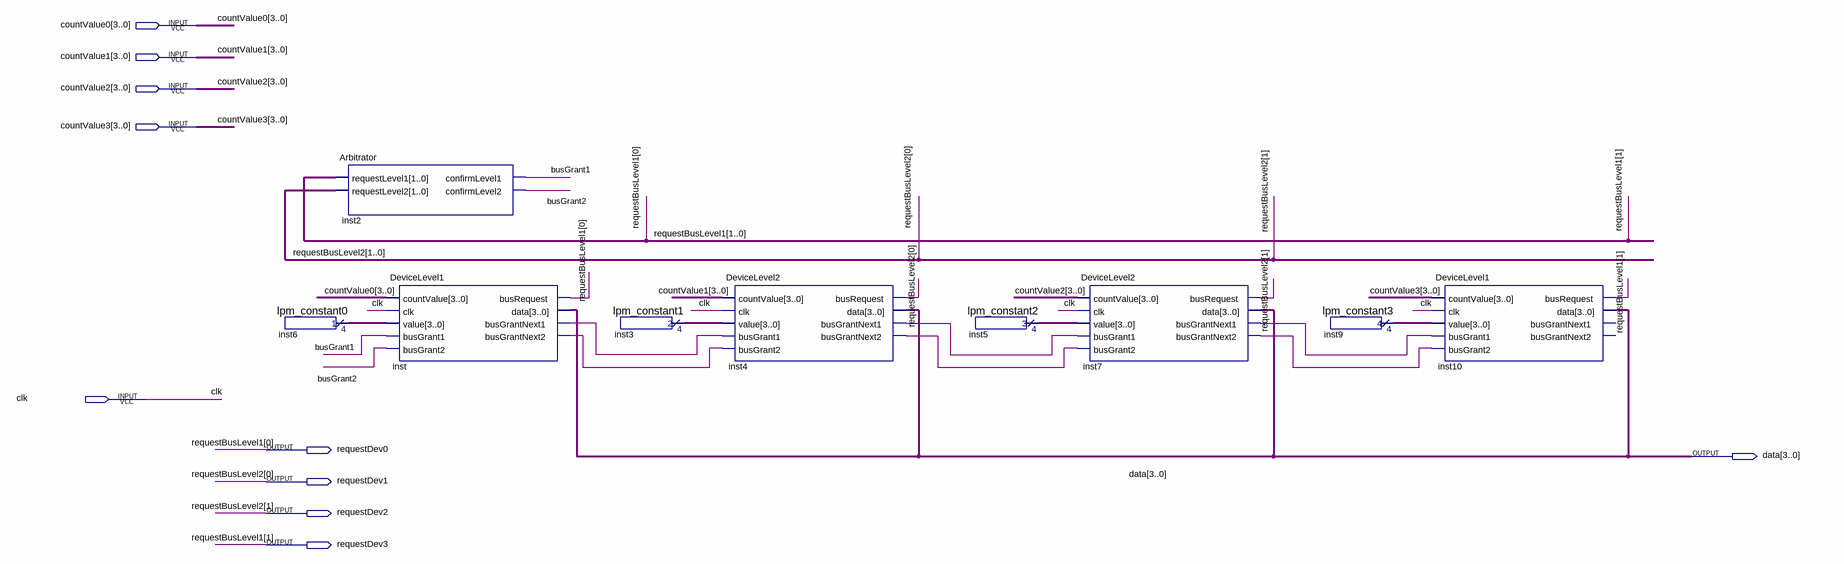
[diagram p0: schematic sheet]
// Quartus schematic Main.bdf as structural Verilog: 9 symbols, 10 pins
module Main (
  input  [3:0] countValue0,
  input  [3:0] countValue1,
  input  [3:0] countValue2,
  input  [3:0] countValue3,
  input  clk,
  output requestDev0,
  output [3:0] data,
  output requestDev1,
  output requestDev2,
  output requestDev3
);

  wire busGrant1, busGrant2, inst4_busgrantnext1, inst4_busgrantnext2, inst7_busgrantnext1,
       inst7_busgrantnext2, inst_busgrantnext1, inst_busgrantnext2;
  wire [3:0] inst3_result, inst5_result, inst6_result, inst9_result;

  lpm_constant0 inst6 (.result(inst6_result));
  Arbitrator inst2 (
    .requestLevel1({requestDev3, requestDev0}), .requestLevel2({requestDev2, requestDev1}),
    .confirmLevel1(busGrant1), .confirmLevel2(busGrant2));
  DeviceLevel1 inst (
    .countValue(countValue0), .clk(clk), .value(inst6_result), .busGrant1(busGrant1), .busGrant2(busGrant2),
    .busRequest(requestDev0), .data(data), .busGrantNext1(inst_busgrantnext1),
    .busGrantNext2(inst_busgrantnext2));
  lpm_constant1 inst3 (.result(inst3_result));
  DeviceLevel2 inst4 (
    .countValue(countValue1), .clk(clk), .value(inst3_result), .busGrant1(inst_busgrantnext1),
    .busGrant2(inst_busgrantnext2), .busRequest(requestDev1), .data(data),
    .busGrantNext1(inst4_busgrantnext1), .busGrantNext2(inst4_busgrantnext2));
  lpm_constant2 inst5 (.result(inst5_result));
  DeviceLevel2 inst7 (
    .countValue(countValue2), .clk(clk), .value(inst5_result), .busGrant1(inst4_busgrantnext1),
    .busGrant2(inst4_busgrantnext2), .busRequest(requestDev2), .data(data),
    .busGrantNext1(inst7_busgrantnext1), .busGrantNext2(inst7_busgrantnext2));
  lpm_constant3 inst9 (.result(inst9_result));
  DeviceLevel1 inst10 (
    .countValue(countValue3), .clk(clk), .value(inst9_result), .busGrant1(inst7_busgrantnext1),
    .busGrant2(inst7_busgrantnext2), .busRequest(requestDev3), .data(data));  // open: busGrantNext1, busGrantNext2

  // Other names for the same wires on the sheet: requestBusLevel1[1:0] = {requestDev3, requestDev0};
  //   requestBusLevel2[1:0] = {requestDev2, requestDev1}
endmodule
